# Altium schematic sheet 1. Power supply.SchDoc
size A4
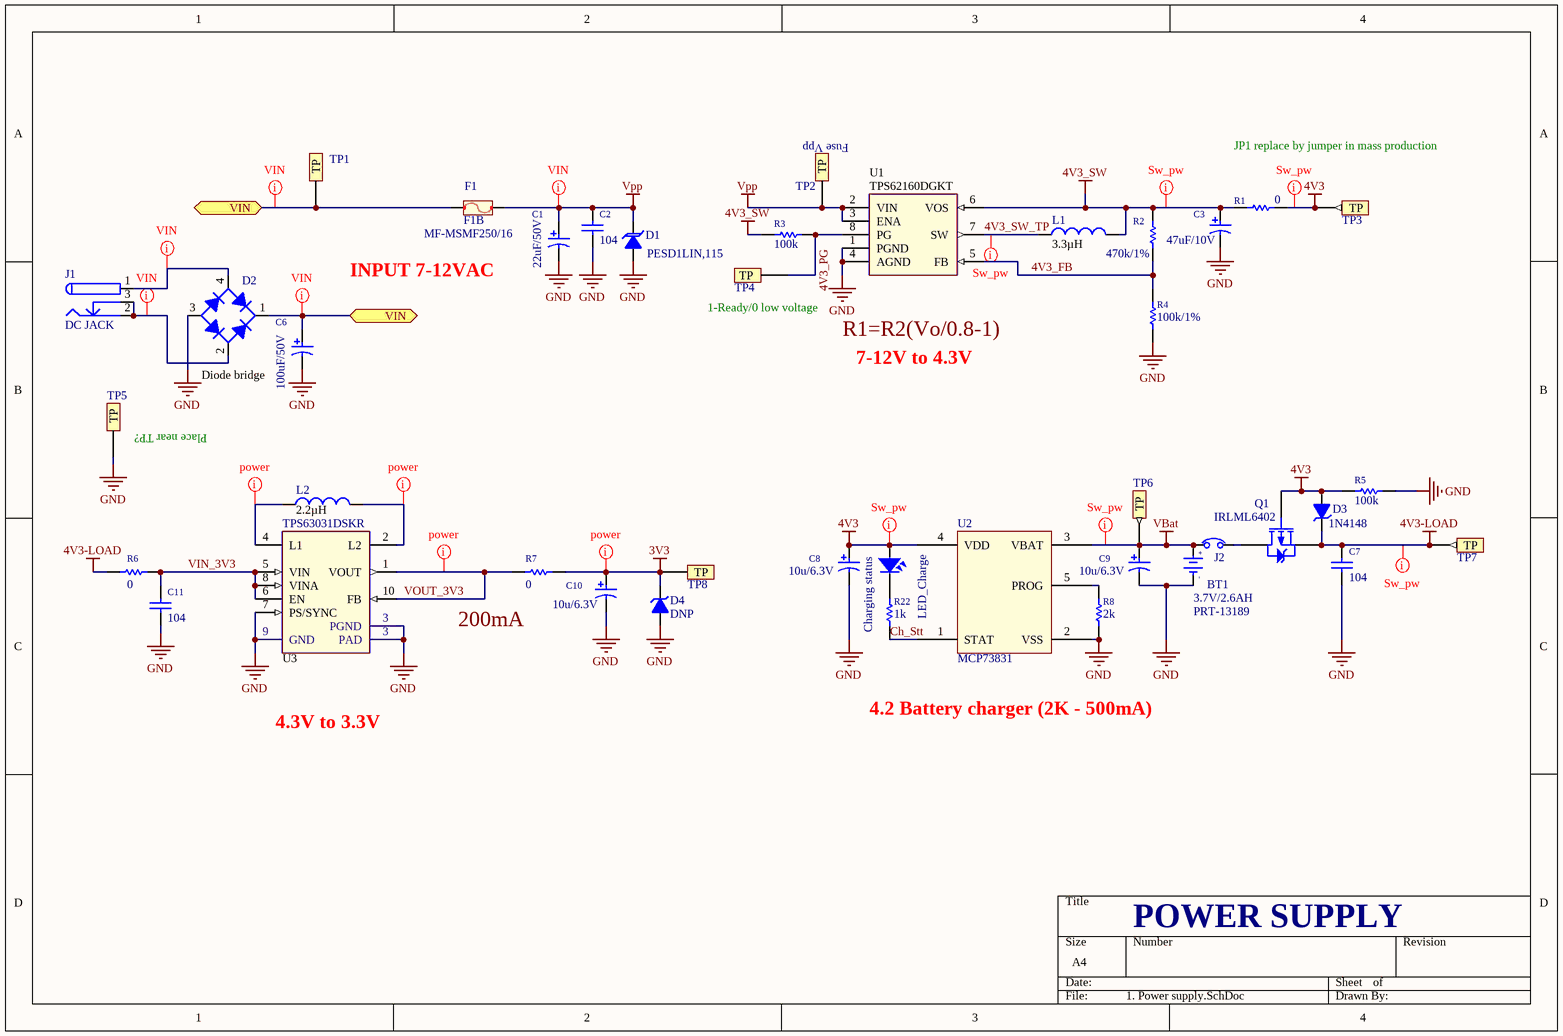
[diagram p0: 1. Power supply.SchDoc]

## Parts
BT1  3.7V/2.6AH  value PRT-13189  [Batterry Cell]
C1  value 22uF/50V  [CAP_SMD_6_3MM_N]  (hidden comment: 22uu/50V)
C2  104  [sm-0603-c]
C3  value 47uF/10V  [Cap SMD Tant - 470u]  (hidden comment: 47uF)
C6  value 100uF/50V  [CAP SMD ALUMINUM G.CAOVANHUONG]  (hidden comment: 22uu/50V)
C7  104  [sm-0603-c]
C8  value 10u/6.3V  [Cap SMD Tant 10u]  (hidden comment: 10u)
C9  value 10u/6.3V  [Cap SMD Tant 10u]  (hidden comment: 10u)
C10  value 10u/6.3V  [Cap SMD Tant 10u]  (hidden comment: 10u)
C11  104  [sm-0603-c]
D1  PESD1LIN,115  [DIODE_SMB]
D2  Diode Bridge  [DB-38R]
D3  1N4148  [DIODE-SOD80]
D4  DNP  [DIODE-SOD80]
F1  F1B  value MF-MSMF250/16  [SMD-PTC]
J1  DC JACK  [DC JACK.CAOVANHUONG]
J2  jumper selector  [CON.HDR1X2]  (value not drawn)
L1  3.3µH  [Inductor 2]
L2  2.2µH  [INDUCTOR 4]
LED_Charge  Charging status  [LED0603]
Q1  IRLML6402  [SOT23-3.CAOVANHUONG]
R1  0  [R2012-0805]
R2  value 470k/1%  [SM-0603-R]  (hidden comment: 470k)
R3  100k  [SM-0603-R]
R4  value 100k/1%  [SM-0603-R]  (hidden comment: 100k)
R5  100k  [SM-0603-R]
R6  0  [R2012-0805]
R7  0  [R2012-0805]
R8  value 2k  [SM-0603-R]  (hidden comment: 100k)
R22  1k  [SM-0603-R]
TP1  Vin  [TP]  (value not drawn)  (no BOM)
TP2  VIN  [TP]  (value not drawn)  (no BOM)
TP3  4V3  [TP]  (value not drawn)  (no BOM)
TP4  4V3_PG  [TP]  (value not drawn)  (no BOM)
TP5  GND  [TP]  (value not drawn)  (no BOM)
TP6  4V3  [TP]  (value not drawn)  (no BOM)
TP7  4V3  [TP]  (value not drawn)  (no BOM)
TP8  TP  [TP]  (value not drawn)  (no BOM)
U1  TPS62160DGKT  [SSOP8.S-PDSO-G8]
U2  MCP73831  [SOT23-5.CAOVANHUONG]
U3  TPS63031DSKR  [WSON10]

## Ports
VIN

## Nets
3V3: C10.1 D4.2(K) R7.2 TP8.1(TP)
4V3: C8.1 D3.1(A) LED_Charge.1 Q1.1(G) R1.2 R5.1 TP3.1(TP) U2.4(VDD)
4V3-LOAD: C7.1 D3.2(K) Q1.2(S) R6.1 TP7.1(TP)
4V3_SW: C3.1 L1.2 R1.1 R2.1 R3.2 U1.6(VOS)
GND: BT1.2(GND) C1.2 C2.2 C3.2 C6.2 C7.2 C8.2 C9.2 C10.2 C11.2 D1.1(A) D2.3(A) D4.1(A) R4.2 R5.2 R8.2 TP5.1(TP) U1.1(PGND) U1.4(AGND) U2.2(VSS) U3.3(PAD) U3.7(PS/SYNC) U3.9(GND)
VBat: BT1.1(+3V) C9.1 J2.1 TP6.1(TP) U2.3(VBAT)
Vpp: C1.1 C2.1 D1.2(K) F1.2 TP2.1(TP) U1.2(VIN) U1.3(ENA)
4V3_FB: R2.2 R4.1 U1.5(FB)
4V3_PG: R3.1 TP4.1(TP) U1.8(PG)
4V3_SW_TP: L1.1 U1.7(SW)
Ch_Stt: R22.1 U2.1(STAT)
VIN: C6.1 D2.1(K) F1.1 TP1.1(TP) ; port VIN
VIN_3V3: C11.1 R6.2 U3.5(VIN) U3.6(EN) U3.8(VINA)
VOUT_3V3: R7.1 U3.1(VOUT) U3.10(FB)
NetD2_2: D2.2(C) J1.2 J1.3
NetD2_4: D2.4(C) J1.1
NetJ2_2: J2.2 Q1.3(D)
NetL2_1: L2.1 U3.4(L1)
NetL2_2: L2.2 U3.2(L2)
NetLED_Charge_2: LED_Charge.2 R22.2
NetR8_1: R8.1 U2.5(PROG)

## Layout directives
rule Width Constraint [Pref Width = 40mil    Min Width = 30mil    Max Width = 50mil]: NetD2_2, NetD2_4, VIN, Vpp
rule Width Constraint [Pref Width = 30mil    Min Width = 10mil    Max Width = 40mil]: 3V3, 4V3, 4V3-LOAD, 4V3_SW, 4V3_SW_TP, NetL2_1, NetL2_2, VBat, VOUT_3V3

## Notes on the sheet
- (near TP2) Fuse Vpp
- JP1 replace by jumper in mass production
- INPUT 7-12VAC
- (near TP4) 1-Ready/0 low voltage
- R1=R2(Vo/0.8-1)
- 7-12V to 4.3V
- (near TP5) Place near TP?
- (near R7) 200mA
- 4.2 Battery charger (2K - 500mA)
- 4.3V to 3.3V
- POWER SUPPLY
- (in symbol PIN 3V) +; -

## Library data of the parts
BT1 = PIN 3V: BATTERY LITHIUM 3.7V 2.6AH; Manufacturer: SparkFun Electronics; Vendor: DIGIKEY; Vendor P/N: 1568-1490-ND; DNP: *; Manufacturer P/N: PRT-13189; Package: 0.72" Dia x 2.56" H; Part: PRT-13189; Price: *
C1 C6 = Cap_Pol: CAP ALUM 22UF 20% 50V SMD; Manufacturer: Panasonic Electronic Components; Manufacturer P/N: EEE-FK1H220P; Part: 22uuF; Vendor: DIGIKEY; Vendor P/N: PCE3811CT-ND; Type: Aluminum Solid/Tantalum Capacitor; Voltage: 50V; Tolerence: 20%
C2 C7 C11 = Capacitor: CAP CER 10000PF 16V 0603; Manufacturer: Taiyo Yuden; Manufacturer P/N: EMK107SD103JA-T; Vendor: DIGIKEY; Vendor P/N: 587-1093-1-ND; Package: 0603; Part: EMK107SD103JA-T; Value: 104; Voltage: 16V
C3 = Cap_Pol: 47uF/10V ±10% SMD Tantalum Capacitor; Manufacturer: AVX; Manufacturer P/N: TAJC476K010RNJ; Voltage: 10V; Type: Aluminum Solid/Tantalum Capacitor; Vendor: www.tme.vn; Vendor P/N: TAJC476K010RNJ; Price: 1600 VND; Part: 47uF; Package: 0603
C8-C10 = Cap_Pol: CAP CER 10UF 6.3V X5R 1206; Manufacturer: Samsung Electro-Mechanics; Manufacturer P/N: CL31A106MQHNNNE; Vendor: DIGIKEY; Vendor P/N: 1276-3045-1-ND; Tollerance: 20%; Voltage: 6.3V; Part: 10u; Package: 1206; DNP: *
D1 = Diode TVS: TVS DIODE 15V/24V 44V/70V SOD323; Manufacturer: Nexperia USA Inc.; Power: 160W; Vendor: DIGIKEY; Vendor P/N: 1727-3818-1-ND; Voltage: 15V; Current: 3A; DNP: *; Manufacturer P/N: PESD1LIN,115; Package: SOD323; Part: PESD1LIN,115; Price: *; Tollerance: *; Value: PESD1LIN,115
D2 = Diode_Bridge: Rectifier Bridge; Vendor: Digikey; Published: 8-Jun-2000; LatestRevisionDate: 17-Jul-2002; LatestRevisionNote: Re-released for DXP Platform.; PackageReference: D-38; ComponentLink1Description: Digikey Part Link; ComponentLink1URL: http://www.irf.com/; ComponentLink2Description: Open Datasheet; ComponentLink2URL: http://www.irf.com/product-info/datasheets/data/1kab-e.pdf; Price: 2000 VND; Date of Price: 19/11/2010; Part: Diode_Bridge; VALUE: Diode bridge
D3 D4 = Diode Zener: Zener Diode; Manufacturer: Unknow; Value: Unknow; DNP: DNP; Manufacturer P/N: Unknow; Package: Unknow; Part: Unknow; Price: Unknow; Vendor: Unknow; Vendor P/N: Unknow; Voltage: Unknow; Current: Unknow
F1 = Fuse: 2.5A/16V SMD-1812 PTC Resettable Fuses; Manufacturer: Bourns Inc.; DNP: *; Manufacturer P/N: MF-MSMF250/16; Package: 1812; Part: MF-MSMF250/16; Vendor: www.tme.vn; Vendor P/N: MF-MSMF250/16; Price: *
J1 = DC JACK: Low Voltage Power Supply Connector; Published: 17-Dec-2003; DatasheetDocument: 09-May-2002; Publisher: Altium Limited; ComponentLink1Description: Manufacturer Link; ComponentLink1URL: http://domino.kycon.com/internet/Products.html
L1 = Inductor: FIXED IND 3.3UH 3.2A 30.2 MOHM; Manufacturer: Bourns Inc.; Manufacturer P/N: SRN6045-3R3Y; Vendor: DIGIKEY; Vendor P/N: SRN6045-3R3YCT-ND; Tollerance: 30%; Part: 3.3µH; Value: 3.3µH; Package: 6.00mm x 6.00mm; Current: 3.2A; Res: 30.2 mOhm
L2 = Inductor: FIXED IND 2.2UH 2.9A 42 MOHM SMD; Manufacturer: Taiyo Yuden; Manufacturer P/N: NRS5020T2R2NMGJ; Vendor: DIGIKEY; Vendor P/N: 587-2405-1-ND; Tollerance: 30%; Res: 42 mOhm; Part: 2.2µH; Value: 2.2µH; Package: 4.90mm x 4.90mm; Current: 2.9A
LED_Charge = LED: LED Single colour Green and Red; Manufacturer: Unknow; Value: LED 3 ly Single Colour; DNP: DNP; Manufacturer P/N: Unknow; Package: Unknow; Part: Unknow; Price: Unknow; Voltage: Unknow; Vendor: Unknow; Vendor P/N: Unknow; Current: Unknow
Q1 = IRLML6402: P-Channel MOSFET, ID =3.7A @ TA = 25°C, VGS @ -4.5V; Published: 8-Jun-2000; LatestRevisionDate: 17-Jul-2002; LatestRevisionNote: Re-released for DXP Platform.; PackageVersion: 1995/1996; PackageReference: E3; Publisher: Altium Limited; PackageDescription: TO, Flat Index; 3 In-Line, Axial Leads; Body Dia. 4.6mm; Lead Dia. 0.5 mm (max)
R1 R6 R7 = Resistor: RES SMD 0 OHM JUMPER 1/10W 0805; Manufacturer: Panasonic Electronic Components; Manufacturer P/N: ERJ-6GEY0R00V; Vendor: DIGIKEY; Vendor P/N: P0.0ACT-ND; Tollerance: 5%; Part: 0; Value: 0; Package: 0805; Power: 1/10W
R2 = Resistor: RES SMD 470K OHM 1% 1/10W 0603; Manufacturer: Panasonic Electronic Components; Manufacturer P/N: ERJ-3EKF4703V; Vendor: DIGIKEY; Vendor P/N: P470KHCT-ND; Tollerance: 1%; Part: 470k; Package: 0603; Power: 1/10W; DNP: *
R3 R5 R8 = Resistor: RES SMD 100K OHM 5% 1/10W 0603; Manufacturer: Panasonic Electronic Components; Manufacturer P/N: ERJ-3GEYJ104V; Vendor: DIGIKEY; Vendor P/N: P100KGCT-ND; Tollerance: 5%; Part: 100k; Package: 0603; Power: 1/10W; DNP: *
  R3 R5: Value: 100k
R4 = Resistor: RES SMD 100K OHM 1% 1/10W 0603; Manufacturer: Panasonic Electronic Components; Manufacturer P/N: ERJ-3EKF1003V; Vendor: DIGIKEY; Vendor P/N: P100KHCT-ND; Tollerance: 1%; Part: 100k; Package: 0603; Power: 1/10W; DNP: *
R22 = Resistor: RES SMD 1K OHM 5% 1/10W 0603; Manufacturer: Panasonic Electronic Components; Manufacturer P/N: ERJ-3GEYJ102V; Vendor: DIGIKEY; Vendor P/N: P1.0KGCT-ND; Tollerance: 5%; Part: 1k; Value: 1k; Package: 0603; Power: 1/10W; DNP: *
TP1-TP8 = TP: Test Point
U1 = TPS62160: IC REG BUCK ADJ 1A SYNC 8VSSOP; Manufacturer: Texas Instruments; Vendor: DIGIKEY; Vendor P/N: 296-30318-1-ND; Value: TPS62160DGKT; Part: TPS62160DGKT; DNP: *; Manufacturer P/N: TPS62160DGKT; Package: VSSOP8
U2 = MCP73831: Miniature Single Cell, Fully Integrated Li-Ion,  Li-Polymer Charge Management ControllerController; Manufacturer: Microchip; Vendor: TME; Vendor P/N: MCP73832T-2ACI/OT; Package: SOT-23-5; Part: MCP73831; Price: 15.000d
U3 = TPS63031: IC REG BUCK BST 3.3V 0.9A 10SON; Manufacturer: Texas Instruments; Vendor: DIGIKEY; Vendor P/N: 296-39461-1-ND; Value: TPS63031DSKR; Part: TPS63031DSKR; DNP: *; Manufacturer P/N: TPS63031DSKR; Package: SON10
J2 = jumper selector: ComponentLink2Description: Open Datasheet; Price: 500 VND; Date of Price: 19/11/2010; Part: jumper selector